# EAGLE design amp (EAGLE 6.5.0)
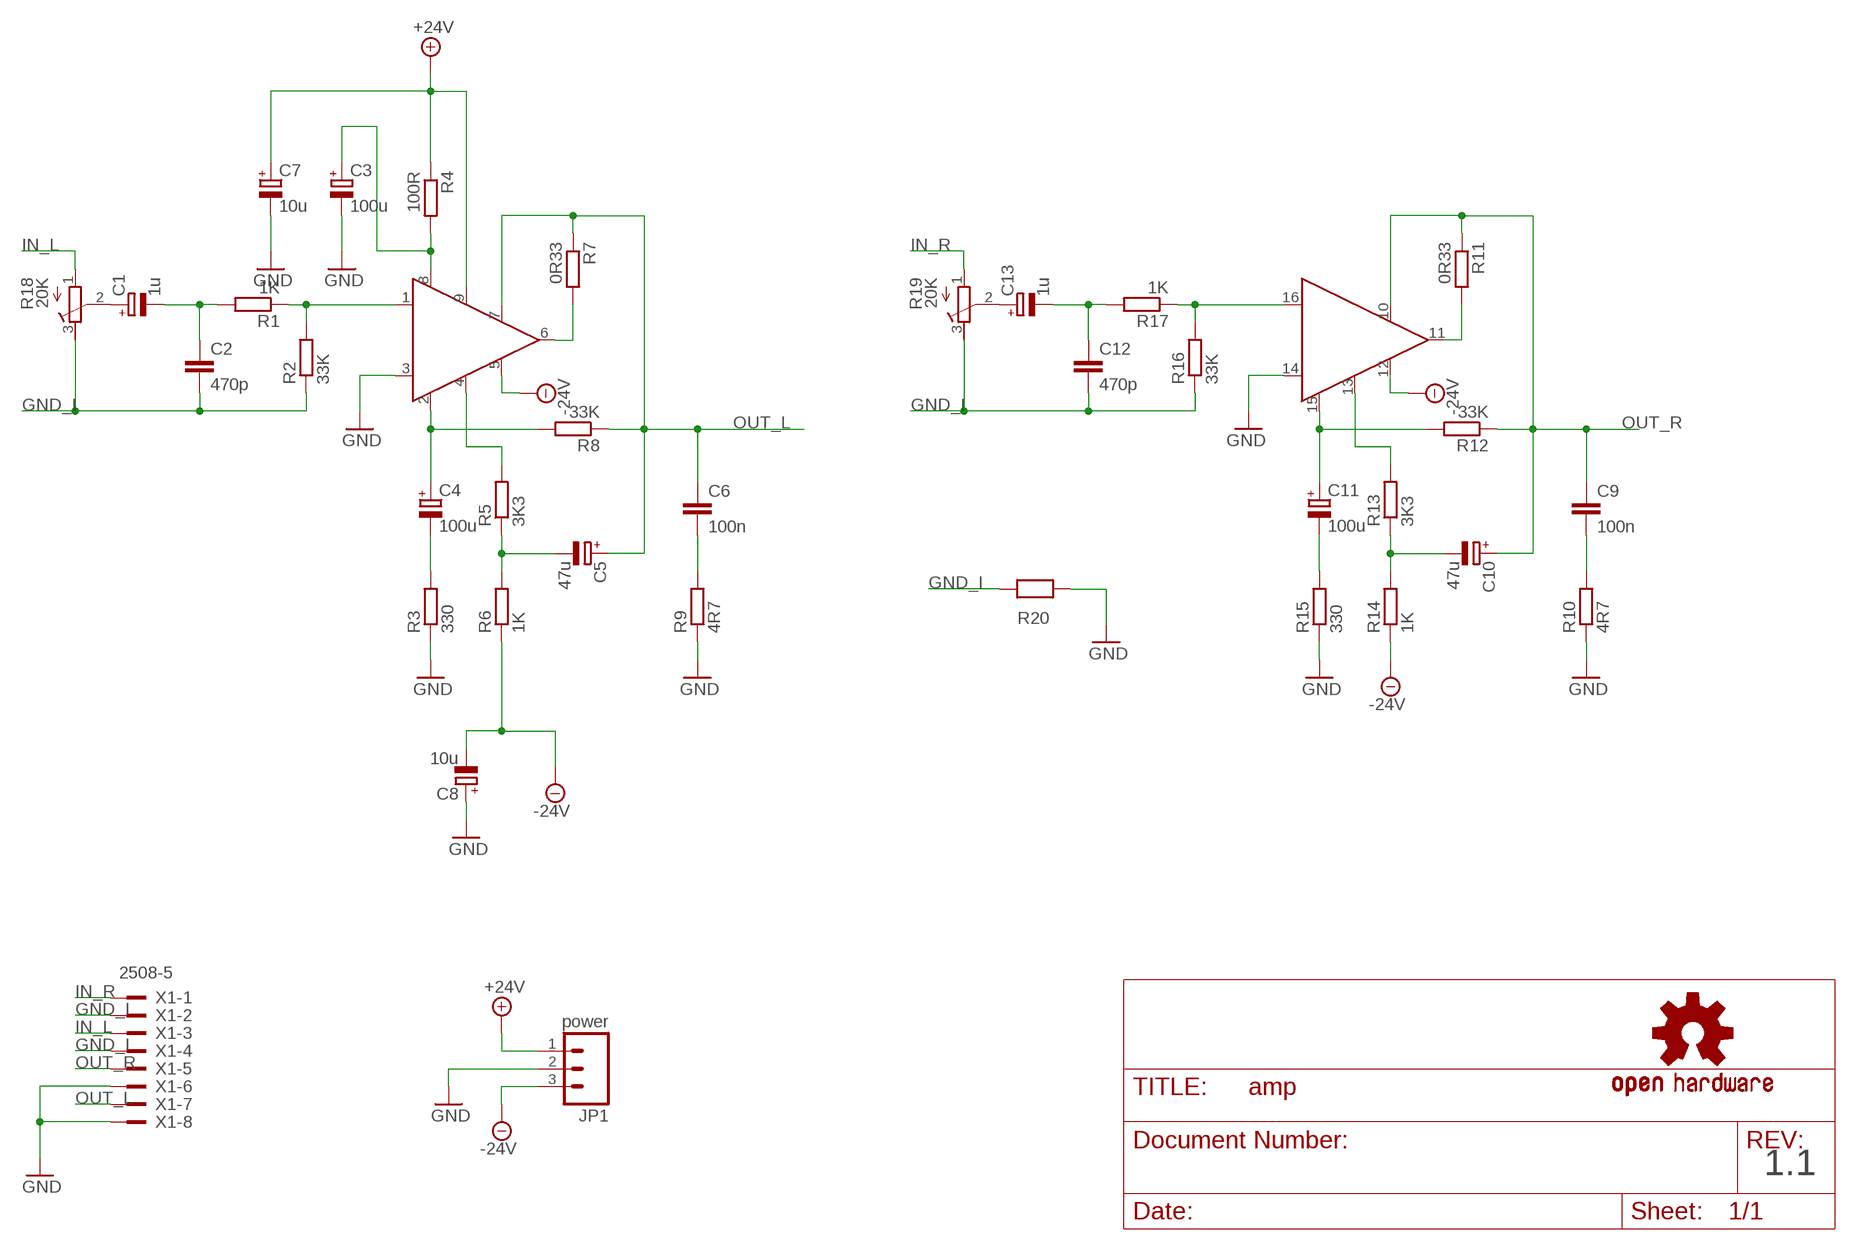
[diagram p0: schematic, sheet 1]

## Parts
C1  1u  CPOL-EUB  [PANASONIC_B]
C2  470p  C-EUC0805  [C0805]
C3  100u  CPOL-EUG  [PANASONIC_G]
C4  100u  CPOL-EUG  [PANASONIC_G]
C5  47u  CPOL-EUF  [PANASONIC_F]
C6  100n  C10/5  [C10B5]
C7  10u  CPOL-EUD  [PANASONIC_D]
C8  10u  CPOL-EUD  [PANASONIC_D]
C9  100n  C10/5  [C10B5]
C10  47u  CPOL-EUF  [PANASONIC_F]
C11  100u  CPOL-EUG  [PANASONIC_G]
C12  470p  C-EUC0805  [C0805]
C13  1u  CPOL-EUB  [PANASONIC_B]
JP1  power  M03PTH  [1X03]
R1  1K  R-EU_R0805W  [R0805W]
R2  33K  R-EU_R0805W  [R0805W]
R3  330  R-EU_0613/15  [P0613/15]
R4  100R  R-EU_0613/15  [P0613/15]
R5  3K3  R-EU_0613/15  [P0613/15]
R6  1K  R-EU_0613/15  [P0613/15]
R7  0R33  R-EU_0613/15  [P0613/15]
R8  33K  R-EU_0613/15  [P0613/15]
R9  4R7  R-EU_0613/15  [P0613/15]
R10  4R7  R-EU_0613/15  [P0613/15]
R11  0R33  R-EU_0613/15  [P0613/15]
R12  33K  R-EU_0613/15  [P0613/15]
R13  3K3  R-EU_0613/15  [P0613/15]
R14  1K  R-EU_0613/15  [P0613/15]
R15  330  R-EU_0613/15  [P0613/15]
R16  33K  R-EU_R0805W  [R0805W]
R17  1K  R-EU_R0805W  [R0805W]
R18  20K  R-TRIMM3339P  [RTRIM3339P]
R19  20K  R-TRIMM3339P  [RTRIM3339P]
R20  0R_0805  [R0805W]
U$1  STK465HORIZ-BOTTOM  [STK465-HB]
U$7  OSHW-LOGOM  [OSHW-LOGO-M]
X1  2508-5  [PAK100/2500-5-08]

## Nets
+24V: C7.+ JP1.1 R4.1 U$1.9
-24V: C8.- JP1.3 R6.1 R14.1 U$1.5 U$1.12
GND: C3.- C7.- C8.+ JP1.2 R3.1 R9.1 R10.1 R15.1 R20.2 U$1.3 U$1.14 X1.6 X1.8
GND_I: C2.2 C12.2 R2.1 R16.1 R18.3(E) R19.3(E) R20.1 X1.2 X1.4
IN_L: R18.1(A) X1.3
IN_R: R19.1(A) X1.1
N$1: C4.- R3.2
N$2: C4.+ R8.2 U$1.2
N$3: C5.- R5.1 R6.2
N$4: C6.2 R9.2
N$5: R7.2 U$1.6
N$6: C3.+ R4.2 U$1.8
N$7: R5.2 U$1.4
N$8: R1.1 R2.2 U$1.1
N$9: C1.- C2.1 R1.2
N$10: C1.+ R18.2(S)
N$11: C13.+ R19.2(S)
N$12: R11.2 U$1.11
N$13: C11.- R15.2
N$14: R16.2 R17.1 U$1.16
N$15: C12.1 C13.- R17.2
N$17: C11.+ R12.2 U$1.15
N$18: C10.- R13.1 R14.2
N$19: R13.2 U$1.13
N$20: C9.2 R10.2
OUT_L: C5.+ C6.1 R7.1 R8.1 U$1.7 X1.7
OUT_R: C9.1 C10.+ R11.1 R12.1 U$1.10 X1.5

## Notes on the sheet
- 1.1

## Library data of the parts
C1 C3-C5 C7 C8 C10 C11 C13 = rcl:CPOL-EU: POLARIZED CAPACITOR, European symbol
C2 C12 = rcl:C-EU: CAPACITOR, European symbol
C6 C9 = capacitor-wima:C: CAPACITOR naming: grid - package width
JP1 = SparkFun-Connectors:M03: Header 3 Standard 3-pin 0.1" header. Use with straight break away headers (SKU : PRT-00116), right angle break away headers (PRT-00553), swiss pins (PRT-00743), machine pins (PRT-00117), and female headers (PRT-00115). Molex polarized connector foot print use with SKU : PRT-08232 with associated crimp pins and housings.
R1-R17 = rcl:R-EU_: RESISTOR, European symbol
R18 R19 = rcl:R-TRIMM: Trimm resistor
R20 = Simplex-Jumpers:0R
U$1 = Simplex-ICs:STK465: STK 461, STK 463, STK 465 stereo amplifier
U$7 = SparkFun:OSHW-LOGO: Open Source Hardware Logo This logo indicates the piece of hardware it is found on incorporates a OSHW license and/or adheres to the definition of open source hardware found here: http://freedomdefined.org/OSHW
X1 = Simplex-Connectors:2508-: 3M (TM) Pak 100 4-Wall Header Source: 3M; OC_FARNELL: 1788669; OC_NEWARK: unknown

## Net classes
1 vcc: width 0.203 mm

## Board
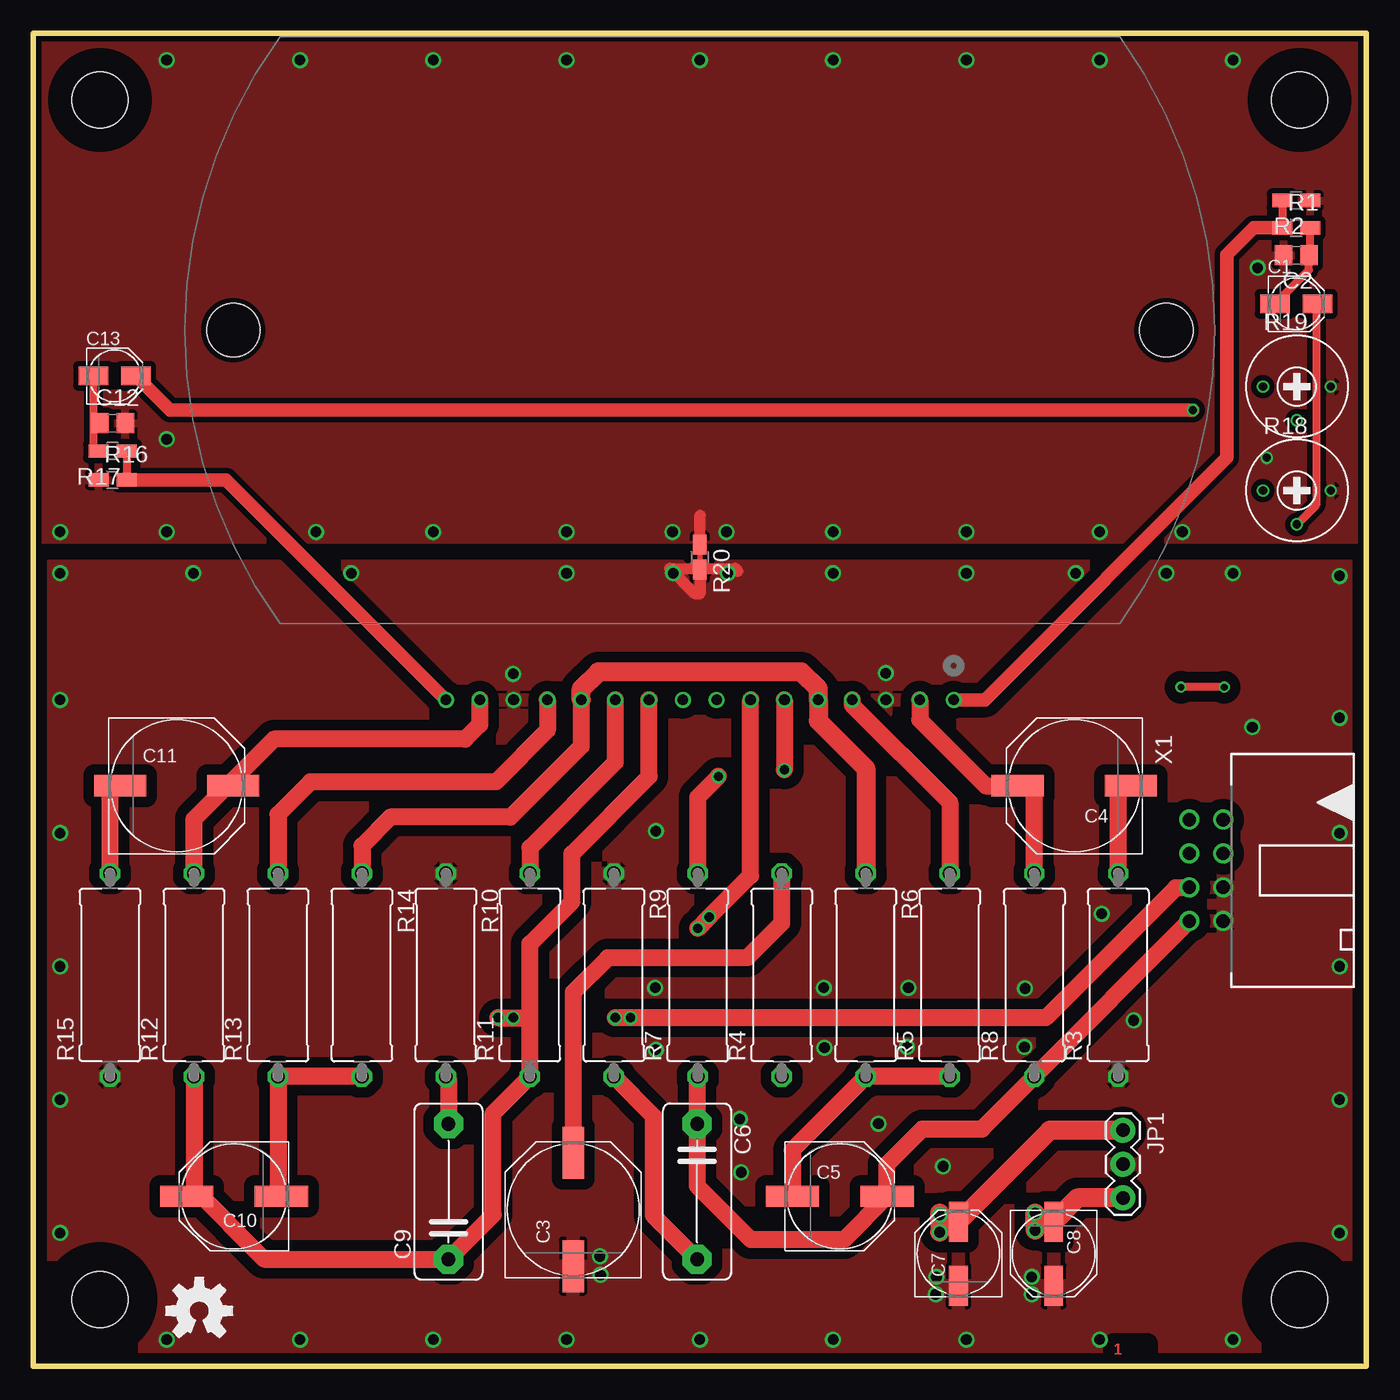
[diagram p1: board, top side]
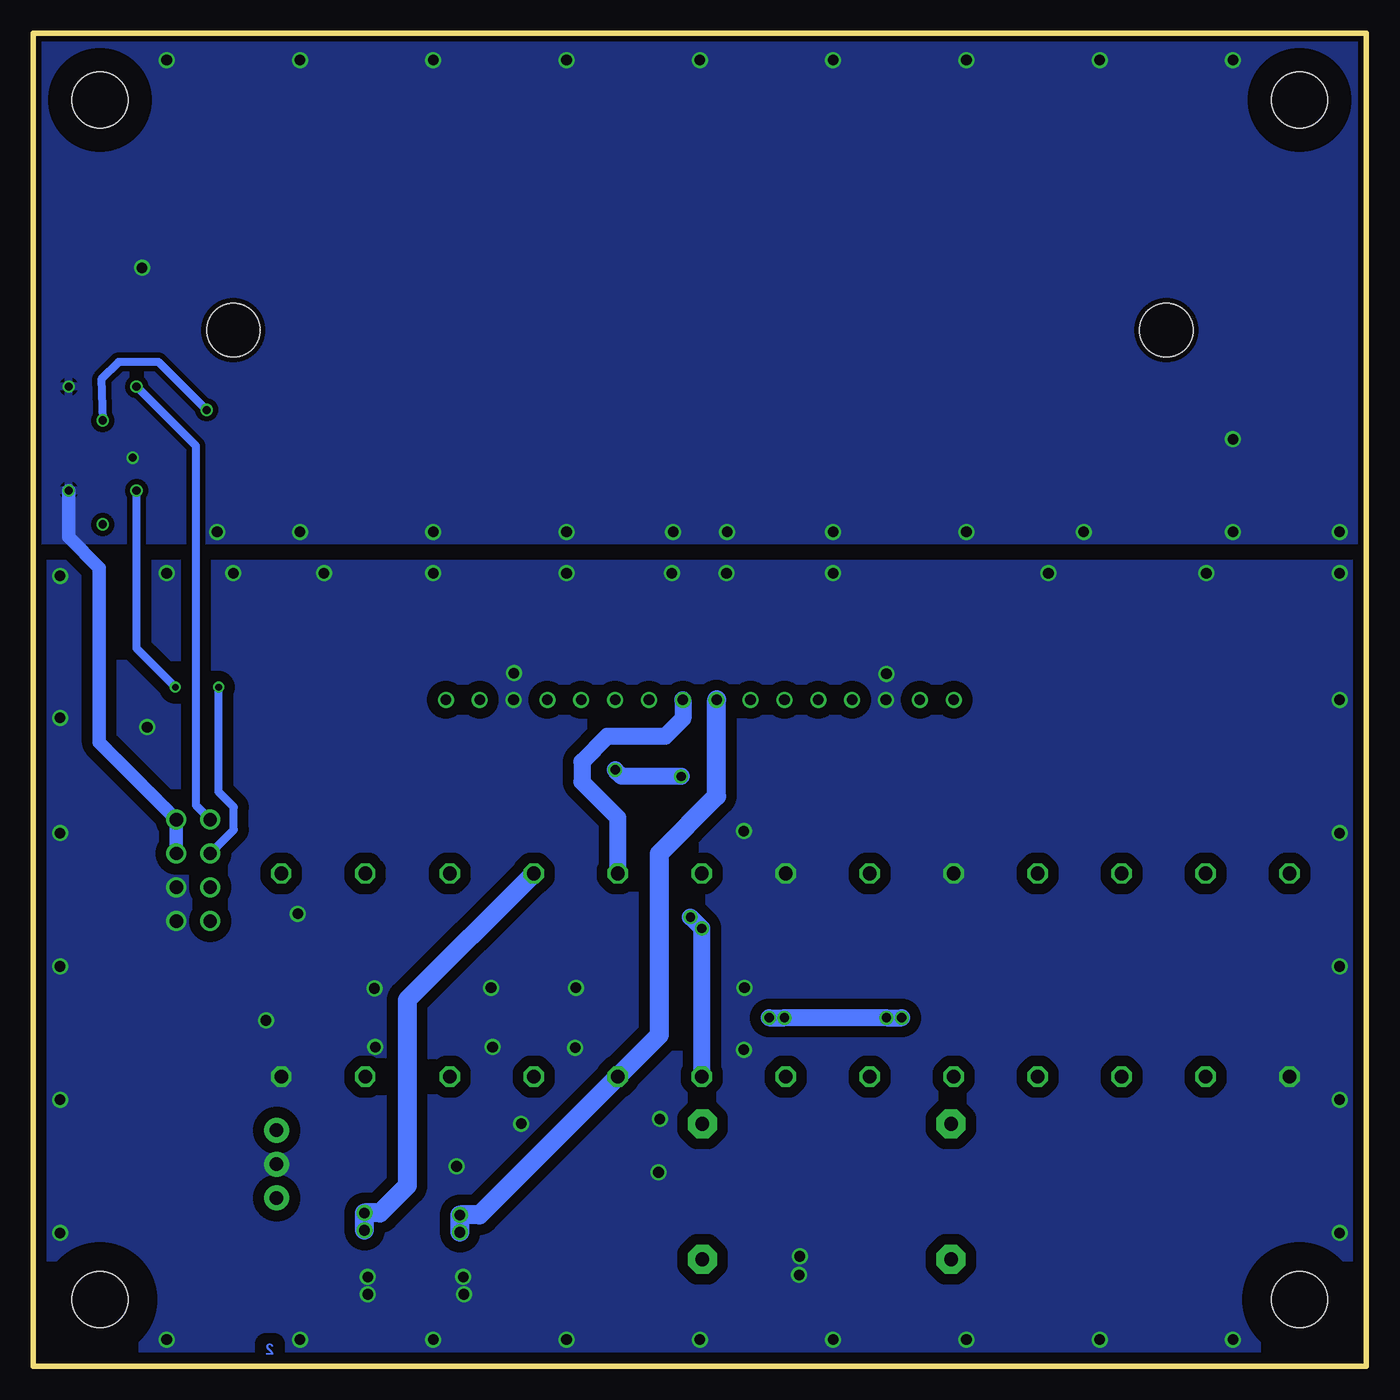
[diagram p2: board, bottom side, seen from below]

Size 100 x 100 mm. Coordinates in mm from the lower left corner, seen from the top.
Outline: 0,0 100,0 100,100 0,100 0,0
Copper layers (1*2*15*16): Top 0.035mm / dielectric 0.2mm / Route2 0.0175mm / dielectric 1.1mm / Route15 0.0175mm / dielectric 0.2mm / Bottom 0.035mm
Design rules "SeeedStudio_DRU_no_angle_20130527": minimum track width 6mil, minimum drill 12mil, track to track 6mil, track to pad 6mil, pad to pad 6mil, via to via 6mil, smd to smd 0mil, copper to edge 10mil, drill to drill 10mil, minimum pad ring 6mil, minimum via ring 6mil, stop-mask expansion 2mil, vias tented up to drill 25mil, thermal gap 10mil
Holes 4.2 mm at 5,95 95,5 5,5 95,95
tRestrict: area 91.7,1.7 to 98.3,8.3; area 91.7,91.7 to 98.3,98.3; area 1.7,1.7 to 8.3,8.3; area 1.7,91.7 to 8.3,98.3
bRestrict: area 1.7,91.7 to 8.3,98.3; area 91.7,91.7 to 98.3,98.3; area 91.7,1.7 to 98.3,8.3; area 1.7,1.7 to 8.3,8.3

### Footprints (pad centres in the part's own frame; a part is rotated, then mirrored left to right if it is on the bottom)
PANASONIC_B = smd 2.2 x 1.4: + 1.6,0; - -1.6,0
C0805 = smd 1.3 x 1.5: 1 -0.95,0; 2 0.95,0
PANASONIC_G = smd 3.9 x 1.6: + 4.25,0; - -4.25,0
PANASONIC_F = smd 4 x 1.6: + 3.55,0; - -3.55,0
C10B5 = drill 1.016 pad 2.159 octagon: 1 -5.08,0; 2 5.08,0
PANASONIC_D = smd 3 x 1.4: + 2.4,0; - -2.4,0
1X03 = drill 1.016 pad 1.88: 1 0,0; 2 2.54,0; 3 5.08,0
R0805W = smd 1.5 x 1: 1 -1.052,0; 2 1.052,0
P0613/15 = drill 1.016 octagon: 1 -7.62,0; 2 7.62,0
RTRIM3339P = drill 0.61: 1 -2.54,0; 2 0,-2.54; 3 2.54,0
R0805W' = smd 1.5 x 1: 1 -0.94,0; 2 0.94,0
STK465-HB = drill 0.8: 1 19.05,0; 2 16.51,0; 3 13.97,0; 4 11.43,0; 5 8.89,0; 6 6.35,0; 7 3.81,0; 8 1.27,0; 9 -1.27,0; 10 -3.81,0; 11 -6.35,0; 12 -8.89,0; 13 -11.43,0; 14 -13.97,0; 15 -16.51,0; 16 -19.05,0 | hole 4: 35,27.73; -35,27.73
PAK100/2500-5-08 = drill 1 pad 1.422: 1 -3.81,-1.27; 2 -3.81,1.27; 3 -1.27,-1.27; 4 -1.27,1.27; 5 1.27,-1.27; 6 1.27,1.27; 7 3.81,-1.27; 8 3.81,1.27

### Placement (x,y rotation side)
C1  94.75,79.7 0 top
C2  94.75,83.35 180 top
C3  40.5,11.75 90 top
C4  78.1,43.55 180 top
C5  60.5,12.75 0 top
C6  49.8,13.1 270 top
C7  69.4,8.45 90 top
C8  76.55,8.45 270 top
C9  31.15,13.1 90 top
C10  15.05,12.75 180 top
C11  10.75,43.55 0 top
C12  5.95,70.75 0 top
C13  6.1,74.3 0 top
JP1  81.75,17.7 270 top
R1  94.75,85.4 0 top
R2  94.75,87.45 180 top
R3  81.4,29.35 90 top
R4  56.15,29.35 90 top
R5  68.75,29.35 90 top
R6  62.45,29.35 270 top
R7  49.85,29.35 90 top
R8  75.1,29.35 90 top
R9  43.55,29.35 270 top
R10  30.95,29.35 270 top
R11  37.25,29.35 90 top
R12  12.05,29.35 90 top
R13  18.35,29.35 90 top
R14  24.65,29.35 270 top
R15  5.75,29.35 90 top
R16  5.95,66.5 0 top
R17  5.95,68.65 180 top
R18  94.8,65.7 0 top
R19  94.8,73.5 0 top
R20  0R_0805  [R0805W']  50,60.7 270 top
U$1  50,50 0 top
U$7  12.45,4.15 0 top
X1  88,37.2 270 top

### Tracks (layer width: path | path; a pad name or v marks a point on that pad's centre or on a via)
+24V  (via drill 0.8)
  Top 1.422: JP1.1 76.25,17.7 C7.+ 68,10.85 v68,11.35 | 68,11.5 v68,11.35 | v68,11.35 v68,10.05
  Bottom 1.422: U$1.9 48.73,42.77 53.05,38.45 53.05,24.83 R4.1 66.53,11.35 v68,11.35 v68,10.05
-24V  (via drill 0.8)
  Top 1.27: U$1.12 41.11,46.51 35.8,41.2 26.8,41.2 24.65,39.05 R14.1
  Top 1.422: U$1.12 41.11,50.81 42.4,52.1 57.6,52.1 58.89,50.81 U$1.5 58.89,48.41 62.45,44.85 R6.1 | JP1.3 78.32,12.62 C8.- 75.15,10.85 v75.15,11.5 | 75.15,11.45 v75.15,10.2
  Bottom 1.422: R6.1 71.95,27.47 71.95,13.55 74,11.5 v75.15,11.5 | 75.1,11.5 v75.15,11.5 | v75.15,10.2 v75.15,11.5
GND  (via drill 0.8)
  Top 0.813: R20.2 50,57.95 49.65,57.95 47.75,59.85 52.65,59.85 52.85,59.65
  other vias: 36,51.95 63.95,52 90,59.5 48,59.5 52.1,59.5 10,2 20,2 30,2 40,2 50,2 60,2 70,2 80,2 90,2 2,10 2,20 2,30 2,40 2,50 2,59.5 12,59.5 23.85,59.5 40,59.5 60,59.5 70,59.5 85,59.5 78.2,59.5 98,10 98,20 98,30 98,40 98,48.65 98,59.3 67.75,6.7 67.7,5.4 74.9,6.7 74.9,5.4 53.1,14.55 53,18.55 59.35,23.9 65.55,23.95 74.35,23.95 74.4,28.35 65.65,28.4 59.3,28.4 46.65,28.4 46.7,23.75 80.15,33.95 82.55,25.95 46.7,40.15 63.4,18.2 68.25,15 91.45,47.95 42.5,8.25 42.55,6.85
  pour Bottom (isolate 0.813, no thermals): 0,60 100,60 100,0 0,0
  pour Top (isolate 0.813): 0,60 100,60 100,0 0,0
GND_I  (via drill 0.6, 0.8)
  Top 0.813: R20.1 50,63.8 50.05,63.85
  Bottom 1.016: X1.4 X1.2 95.05,46.8 95.05,59.9 97.35,62.2 R18.3
  other vias: 92.55,68.15 86.2,62.6 2,62.6 10,62.6 21.2,62.6 30,62.6 40,62.6 47.95,62.6 52,62.6 60,62.6 70,62.6 80,62.6 10,98 20,98 30,98 40,98 50,98 60,98 70,98 80,98 90,98 10,69.55 91.85,82.4
  pour Top (isolate 0.406): 0,100 100,100 100,62 0,62
  pour Bottom (isolate 0.406): 0,100 100,100 100,62 0,62
IN_L  (via drill 0.5)
  Top 0.61: v89.35,50.95 v86.1,50.95
  Bottom 0.61: X1.3 84.95,40.25 84.95,41.95 86.1,43.1 v86.1,50.95 | v89.35,50.95 92.26,53.86 R18.1
IN_R
  Bottom 0.61: R19.1 87.8,69.04 87.8,42.08 X1.1
N$1
  Top 1.27: R3.2 81.4,43.1 C4.-
N$2
  Top 1.27: U$1.2 66.51,48.49 71.45,43.55 C4.+ 74.45,43.55 75.1,42.9 R8.2
N$3
  Top 1.27: R5.1 R6.2 56.95,16.23 C5.-
N$4
  Top 1.27: R9.2 46.5,18.78 46.5,11.32 C6.2
N$5  (via drill 0.7)
  Top 1.27: U$1.6 v56.35,44.75 | R7.2 49.85,42.7 v51.4,44.25
  Bottom 1.27: v51.4,44.25 55.85,44.25 v56.35,44.75
N$6
  Top 1.27: C3.+ 40.5,28.05 43.1,30.65 53.55,30.65 56.15,33.25 R4.2
  Bottom 1.27: U$1.8 51.27,48.58 52.6,47.25 56.95,47.25 58.85,45.35 58.85,43.85 56.15,41.15 R4.2
N$7
  Top 1.27: U$1.4 61.43,49.62 68.75,42.3 R5.2
N$8
  Top 0.61: R2.2 R1.1
  Top 1.016: U$1.1 71.4,50 89.55,68.15 89.55,83.4 91.55,85.4 R1.1
N$9
  Top 0.61: R1.2 95.8,83.45 C2.1 95.7,82.25 C1.-
N$10
  Top 0.61: C1.+ 96.25,79.6 96.25,64.61 R18.2
N$11  (via drill 0.6)
  Top 1.016: v87,71.75 10.25,71.75 C13.+
  Bottom 0.61: R19.2 94.9,74.05 93.6,75.35 90.6,75.35 v87,71.75
N$12
  Top 1.27: U$1.11 43.65,45.3 37.25,38.9 R11.2
N$13
  Top 1.27: R15.2 5.75,43.25 arc-90 C11.-
N$14
  Top 0.61: R17.1 R16.2
  Top 1.016: R16.2 14.45,66.5 U$1.16
N$15
  Top 0.61: C13.- 4.5,70.65 | 4.5,70.65 4.5,69.05 R17.2 | C12.1 4.6,70.75 4.5,70.65
N$17
  Top 1.27: R12.2 12.05,41.05 14.72,43.73 | U$1.15 33.49,48.14 32.4,47.05 18.05,47.05 14.72,43.73 | C11.+ 14.82,43.73 14.72,43.73
N$18
  Top 1.27: R14.2 R13.1 18.35,13 arc90 C10.-
N$19
  Top 1.27: U$1.13 38.57,47.72 34.7,43.85 20.8,43.85 18.35,41.4 R13.2
N$20
  Top 1.27: R10.2 31.15,21.53 C9.2
OUT_L  (via drill 0.7)
  Top 1.27: X1.7 75.1,21.76 R8.1 71.17,17.8 66.7,17.8 64.05,15.15 C5.+ 60.8,9.5 53.85,9.5 49.8,13.55 C6.1 49.8,21.73 R7.1 | v49.85,32.85 v50.7,33.7 53.81,36.81 U$1.7
  Bottom 1.27: R7.1 v49.85,32.85 v50.7,33.7
OUT_R  (via drill 0.7)
  Top 1.27: R12.1 12.05,13.3 | 12.05,13.3 arc-90 C10.+ | 12.05,13.3 17.33,8.02 C9.1 34.5,11.37 34.5,18.98 R11.1 37.25,26.15 | U$1.10 46.2,44.25 40.4,38.45 40.4,34.85 37.25,31.7 37.25,26.75 37.25,26.15 | X1.5 86.7,35.9 85.7,35.9 75.95,26.15 v43.65,26.15 | v34.85,26.15 37.25,26.15
  Bottom 1.27: v44.8,26.15 v43.65,26.15 v36,26.15 v34.85,26.15

### Text on the board
Top: 1
Bottom: 2
tmine: R | L | power / / +24V / GND / -24V | IO / / IN_R GND / IN_L GND / OUT_R GND / OUT_L GND | 2x25W amplifier circuit rev 1.1 / github.com/rodan/ampy / author: petre rodan / date: apr 2014